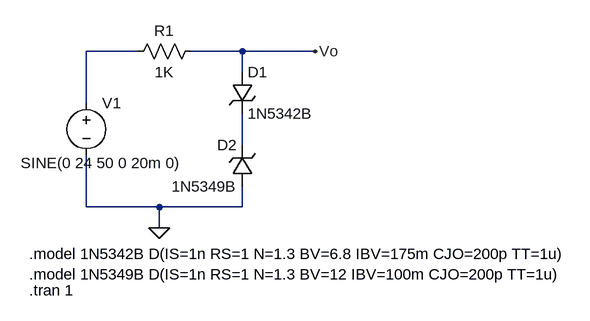
[diagram p0: schematic TP2_zener_2.asc]
TP2_zener_2.asc, the LTspice schematic file:
Version 4.1
SHEET 1 928 680
WIRE 176 96 96 96
WIRE 336 96 256 96
WIRE 448 96 336 96
WIRE 336 128 336 96
WIRE 96 176 96 96
WIRE 336 240 336 192
WIRE 96 336 96 256
WIRE 208 336 96 336
WIRE 336 336 336 304
WIRE 336 336 208 336
WIRE 208 368 208 336
FLAG 448 96 Vo
FLAG 208 368 0
SYMBOL res 272 80 R90
WINDOW 0 0 56 VBottom 2
WINDOW 3 32 56 VTop 2
SYMATTR InstName R1
SYMATTR Value 1K
SYMBOL zener 320 128 R0
SYMATTR InstName D1
SYMATTR Value 1N5342B
SYMBOL zener 352 304 R180
WINDOW 0 24 64 Left 2
WINDOW 3 24 0 Left 2
SYMATTR InstName D2
SYMATTR Value 1N5349B
SYMBOL voltage 96 160 R0
WINDOW 3 -101 108 Left 2
WINDOW 123 0 0 Left 0
WINDOW 39 0 0 Left 0
SYMATTR Value SINE(0 24 50 0 20m 0)
SYMATTR InstName V1
TEXT 8 408 Left 2 !.model 1N5342B D(IS=1n RS=1 N=1.3 BV=6.8 IBV=175m CJO=200p TT=1u)\n.model 1N5349B D(IS=1n RS=1 N=1.3 BV=12 IBV=100m CJO=200p TT=1u)
TEXT 8 464 Left 2 !.tran 1

The netlist it stands for:
* TP2_zener_2.asc
R1 Vo N001 1K
D1 Vo N002 1N5342B
D2 0 N002 1N5349B
V1 N001 0 SINE(0 24 50 0 20m 0)
.model D D
.lib standard.dio
.model 1N5342B D(IS=1n RS=1 N=1.3 BV=6.8 IBV=175m CJO=200p TT=1u)
.model 1N5349B D(IS=1n RS=1 N=1.3 BV=12 IBV=100m CJO=200p TT=1u)
.tran 1
.backanno
.end